# Altium schematic sheet Power_Distribution_TopLevel.SchDoc
size A4; DocumentNumber: 46; SheetNumber: 46; SheetTotal: 47
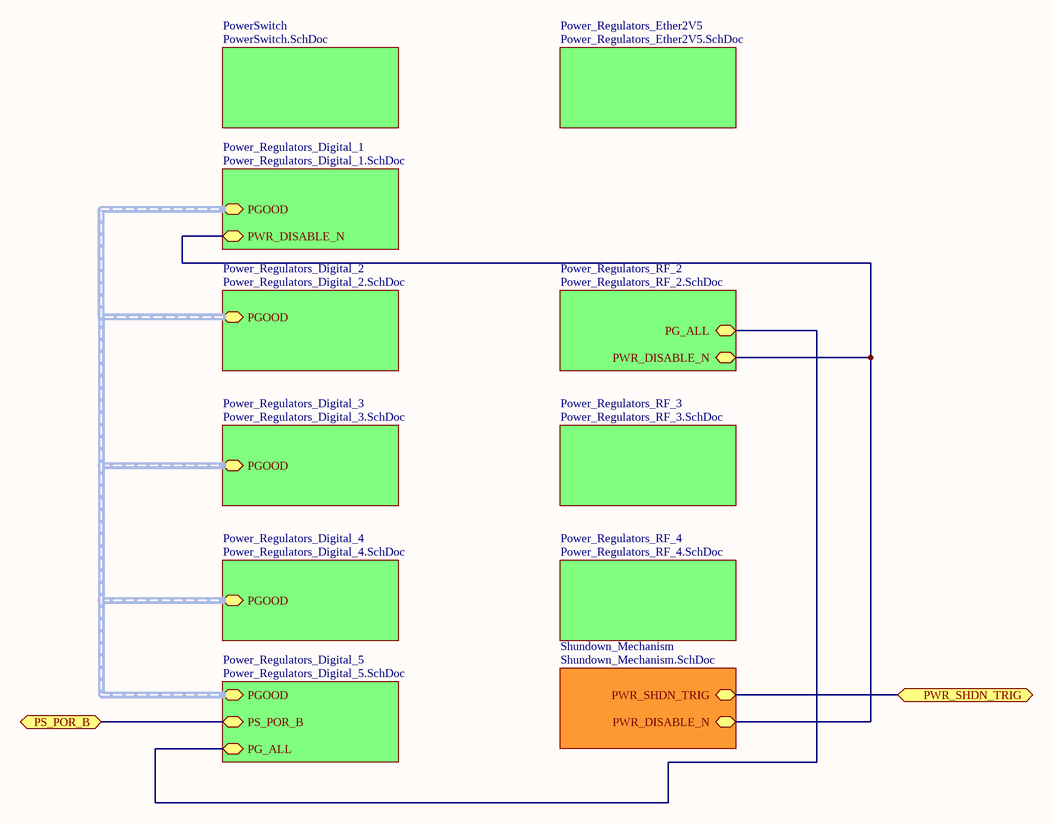
[diagram p0: Power_Distribution_TopLevel.SchDoc]

## Sub-sheets
Power_Regulators_Digital_1 = Power_Regulators_Digital_1.SchDoc: PGOOD (harness PGOOD), PWR_DISABLE_N (bidir)
Power_Regulators_Digital_2 = Power_Regulators_Digital_2.SchDoc: PGOOD (harness PGOOD)
Power_Regulators_Digital_3 = Power_Regulators_Digital_3.SchDoc: PGOOD (harness PGOOD)
Power_Regulators_Digital_4 = Power_Regulators_Digital_4.SchDoc: PGOOD (harness PGOOD)
Power_Regulators_Digital_5 = Power_Regulators_Digital_5.SchDoc: PGOOD (harness PGOOD), PS_POR_B (bidir), PG_ALL (bidir)
Power_Regulators_Ether2V5 = Power_Regulators_Ether2V5.SchDoc: no entries
Power_Regulators_RF_2 = Power_Regulators_RF_2.SchDoc: PG_ALL (bidir), PWR_DISABLE_N (bidir)
Power_Regulators_RF_3 = Power_Regulators_RF_3.SchDoc: no entries
Power_Regulators_RF_4 = Power_Regulators_RF_4.SchDoc: no entries
PowerSwitch = PowerSwitch.SchDoc: no entries
Shundown_Mechanism = Shundown_Mechanism.SchDoc: PWR_SHDN_TRIG, PWR_DISABLE_N (bidir)

## Ports
PS_POR_B (bidir), PWR_SHDN_TRIG (bidir)

## Nets
PS_POR_B: port PS_POR_B, sheet Power_Regulators_Digital_5/PS_POR_B
PWR_SHDN_TRIG: port PWR_SHDN_TRIG, sheet Shundown_Mechanism/PWR_SHDN_TRIG
(unnamed): sheet Power_Regulators_Digital_1/PWR_DISABLE_N, sheet Power_Regulators_RF_2/PWR_DISABLE_N, sheet Shundown_Mechanism/PWR_DISABLE_N
(unnamed): sheet Power_Regulators_Digital_5/PG_ALL, sheet Power_Regulators_RF_2/PG_ALL

## Buses and harness runs
harness sheet Power_Regulators_Digital_1/PGOOD = sheet Power_Regulators_Digital_2/PGOOD = sheet Power_Regulators_Digital_3/PGOOD = sheet Power_Regulators_Digital_4/PGOOD = sheet Power_Regulators_Digital_5/PGOOD